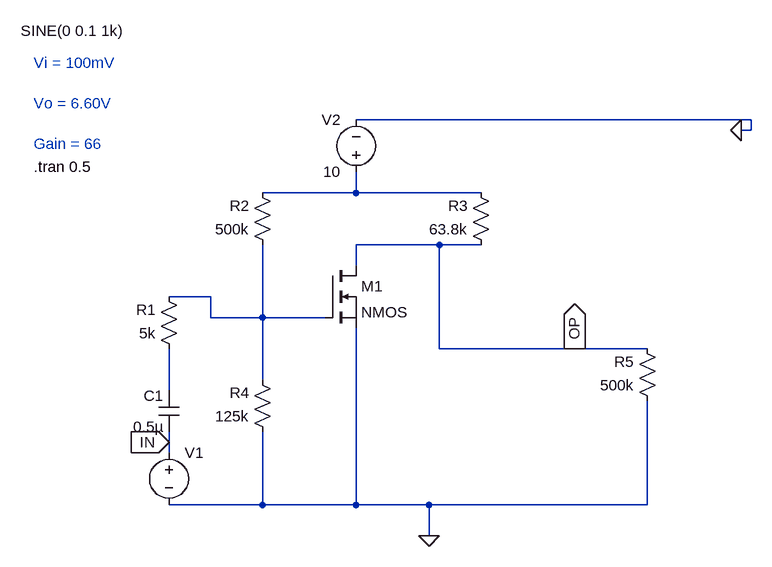
[diagram p0: schematic NNM24EE066_Faiz.asc]
NNM24EE066_Faiz.asc, the LTspice schematic file:
Version 4
SHEET 1 880 680
WIRE 640 -256 32 -256
WIRE 640 -240 640 -256
WIRE 640 -240 624 -240
WIRE 32 -144 32 -176
WIRE 32 -144 -112 -144
WIRE 224 -144 32 -144
WIRE 160 -64 32 -64
WIRE 224 -64 160 -64
WIRE 32 -32 32 -64
WIRE -192 16 -256 16
WIRE -192 48 -192 16
WIRE -112 48 -112 -64
WIRE -112 48 -192 48
WIRE -16 48 -112 48
WIRE 160 96 160 -64
WIRE 368 96 160 96
WIRE 480 96 368 96
WIRE -112 144 -112 48
WIRE -256 160 -256 96
WIRE -256 240 -256 224
WIRE -256 256 -256 240
WIRE -112 336 -112 224
WIRE -112 336 -256 336
WIRE 32 336 32 64
WIRE 32 336 -112 336
WIRE 144 336 32 336
WIRE 480 336 480 176
WIRE 480 336 144 336
WIRE 144 384 144 336
FLAG 144 384 0
FLAG -256 240 IN
IOPIN -256 240 In
FLAG 368 96 OP
IOPIN 368 96 Out
FLAG 624 -240 0
SYMBOL voltage -256 240 R0
WINDOW 3 -228 -633 Left 2
WINDOW 123 0 0 Left 0
WINDOW 39 0 0 Left 0
SYMATTR InstName V1
SYMATTR Value SINE(0 0.1 1k)
SYMBOL voltage 32 -160 R180
WINDOW 0 24 96 Left 2
WINDOW 3 24 16 Left 2
WINDOW 123 0 0 Left 0
WINDOW 39 0 0 Left 0
SYMATTR InstName V2
SYMATTR Value 10
SYMBOL nmos -16 -32 R0
SYMATTR InstName M1
SYMBOL res -240 112 R180
WINDOW 0 36 76 Left 2
WINDOW 3 36 40 Left 2
SYMATTR InstName R1
SYMATTR Value 5k
SYMBOL res -96 -48 R180
WINDOW 0 36 76 Left 2
WINDOW 3 36 40 Left 2
SYMATTR InstName R2
SYMATTR Value 500k
SYMBOL res 240 -48 R180
WINDOW 0 36 76 Left 2
WINDOW 3 36 40 Left 2
SYMATTR InstName R3
SYMATTR Value 63.8k
SYMBOL res -96 240 R180
WINDOW 0 36 76 Left 2
WINDOW 3 36 40 Left 2
SYMATTR InstName R4
SYMATTR Value 125k
SYMBOL res 496 192 R180
WINDOW 0 36 76 Left 2
WINDOW 3 36 40 Left 2
SYMATTR InstName R5
SYMATTR Value 500k
SYMBOL cap -240 224 R180
WINDOW 0 24 56 Left 2
WINDOW 3 24 8 Left 2
SYMATTR InstName C1
SYMATTR Value 0.5µ
TEXT -464 -184 Left 2 !.tran 0.5
TEXT -464 -344 Left 2 ;Vi = 100mV\n \nVo = 6.60V\n \nGain = 66

The netlist it stands for:
* NNM24EE066_Faiz.asc
V1 IN 0 SINE(0 0.1 1k)
V2 N001 0 10
M1 OP N002 0 0 NMOS
R1 N003 N002 5k
R2 N002 N001 500k
R3 OP N001 63.8k
R4 0 N002 125k
R5 0 OP 500k
C1 IN N003 0.5µ
.model NMOS NMOS
.model PMOS PMOS
.lib standard.mos
.tran 0.5
* Vi = 100mV
* Vo = 6.60V
* Gain = 66
.backanno
.end